# Altium project PCB_Project1.PrjPCB
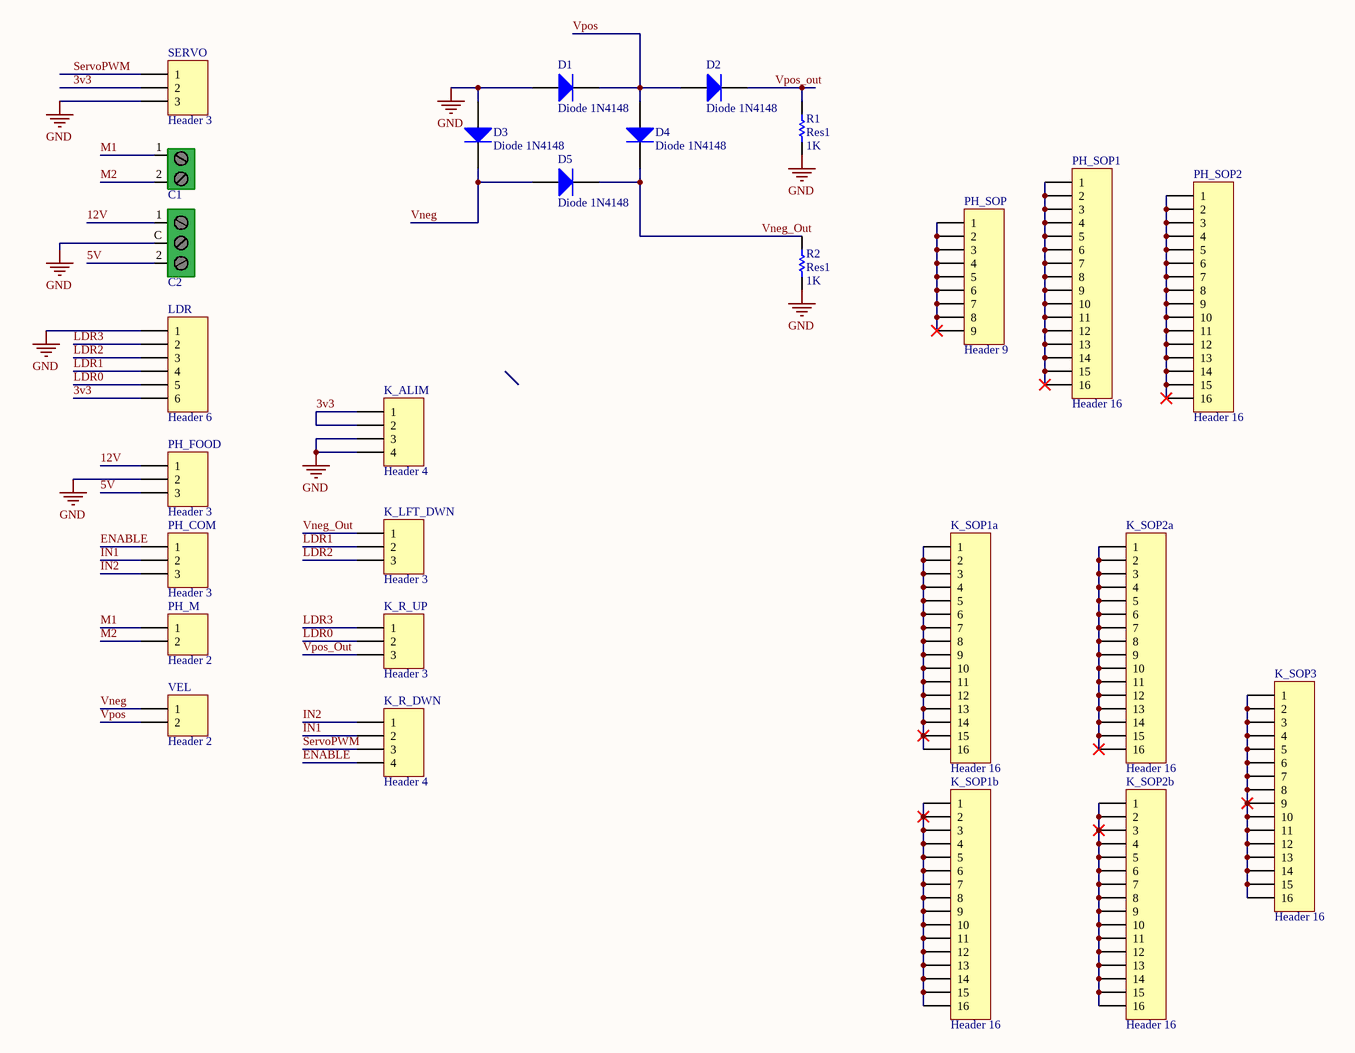
[diagram p0: Sheet1.SchDoc]
1 sheet, 27 parts. Net scope: global (net labels, ports and power ports of the same name join across sheets).
Board file: PCB1.PcbDoc

## Sheet Sheet1.SchDoc
size D

### Parts
C1  Conector_2x  [Conector_2x]  (value not drawn)
C2  Conector_3x  [Conector_3x]  (value not drawn)
D1  Diode 1N4148  [DO-35]
D2  Diode 1N4148  [DO-35]
D3  Diode 1N4148  [DO-35]
D4  Diode 1N4148  [DO-35]
D5  Diode 1N4148  [DO-35]
K_ALIM  Header 4  [HDR1X4]
K_LFT_DWN  Header 3  [HDR1X3]
K_R_DWN  Header 4  [HDR1X4]
K_R_UP  Header 3  [HDR1X3]
K_SOP1a  Header 16  [HDR1X16]
K_SOP1b  Header 16  [HDR1X16]
K_SOP2a  Header 16  [HDR1X16]
K_SOP2b  Header 16  [HDR1X16]
K_SOP3  Header 16  [HDR1X16]
LDR  Header 6  [HDR1X6]
PH_COM  Header 3  [HDR1X3]
PH_FOOD  Header 3  [HDR1X3]
PH_M  Header 2  [HDR1X2]
PH_SOP  Header 9  [HDR1X9]
PH_SOP1  Header 16  [HDR1X16]
PH_SOP2  Header 16  [HDR1X16]
R1  Res1  value 1K  [AXIAL-0.3]
R2  Res1  value 1K  [AXIAL-0.3]
SERVO  Header 3  [HDR1X3]
VEL  Header 2  [HDR1X2]

### Nets
GND: C2.C D1.1(A) D3.1(A) K_ALIM.3 K_ALIM.4 LDR.1 PH_FOOD.2 R1.1 R2.1 SERVO.3
3v3: K_ALIM.1 K_ALIM.2 LDR.6 SERVO.2
5V: C2.2 PH_FOOD.3
12V: C2.1 PH_FOOD.1
ENABLE: K_R_DWN.4 PH_COM.1
IN1: K_R_DWN.2 PH_COM.2
IN2: K_R_DWN.1 PH_COM.3
LDR0: K_R_UP.2 LDR.5
LDR1: K_LFT_DWN.2 LDR.4
LDR2: K_LFT_DWN.3 LDR.3
LDR3: K_R_UP.1 LDR.2
M1: C1.1 PH_M.1
M2: C1.2 PH_M.2
ServoPWM: K_R_DWN.3 SERVO.1
Vneg: D3.2(K) D5.1(A) VEL.1
Vneg_Out: D4.2(K) D5.2(K) K_LFT_DWN.1 R2.2
Vpos: D1.2(K) D2.1(A) D4.1(A) VEL.2
Vpos_out: D2.2(K) K_R_UP.3 R1.2
NetK_SOP1a_1: K_SOP1a.1 K_SOP1a.2 K_SOP1a.3 K_SOP1a.4 K_SOP1a.5 K_SOP1a.6 K_SOP1a.7 K_SOP1a.8 K_SOP1a.9 K_SOP1a.10 K_SOP1a.11 K_SOP1a.12 K_SOP1a.13 K_SOP1a.14 K_SOP1a.15 K_SOP1a.16
NetK_SOP1b_1: K_SOP1b.1 K_SOP1b.2 K_SOP1b.3 K_SOP1b.4 K_SOP1b.5 K_SOP1b.6 K_SOP1b.7 K_SOP1b.8 K_SOP1b.9 K_SOP1b.10 K_SOP1b.11 K_SOP1b.12 K_SOP1b.13 K_SOP1b.14 K_SOP1b.15 K_SOP1b.16
NetK_SOP2a_1: K_SOP2a.1 K_SOP2a.2 K_SOP2a.3 K_SOP2a.4 K_SOP2a.5 K_SOP2a.6 K_SOP2a.7 K_SOP2a.8 K_SOP2a.9 K_SOP2a.10 K_SOP2a.11 K_SOP2a.12 K_SOP2a.13 K_SOP2a.14 K_SOP2a.15 K_SOP2a.16
NetK_SOP2b_1: K_SOP2b.1 K_SOP2b.2 K_SOP2b.3 K_SOP2b.4 K_SOP2b.5 K_SOP2b.6 K_SOP2b.7 K_SOP2b.8 K_SOP2b.9 K_SOP2b.10 K_SOP2b.11 K_SOP2b.12 K_SOP2b.13 K_SOP2b.14 K_SOP2b.15 K_SOP2b.16
NetK_SOP3_1: K_SOP3.1 K_SOP3.2 K_SOP3.3 K_SOP3.4 K_SOP3.5 K_SOP3.6 K_SOP3.7 K_SOP3.8 K_SOP3.9 K_SOP3.10 K_SOP3.11 K_SOP3.12 K_SOP3.13 K_SOP3.14 K_SOP3.15 K_SOP3.16
NetPH_SOP1_1: PH_SOP1.1 PH_SOP1.2 PH_SOP1.3 PH_SOP1.4 PH_SOP1.5 PH_SOP1.6 PH_SOP1.7 PH_SOP1.8 PH_SOP1.9 PH_SOP1.10 PH_SOP1.11 PH_SOP1.12 PH_SOP1.13 PH_SOP1.14 PH_SOP1.15 PH_SOP1.16
NetPH_SOP2_1: PH_SOP2.1 PH_SOP2.2 PH_SOP2.3 PH_SOP2.4 PH_SOP2.5 PH_SOP2.6 PH_SOP2.7 PH_SOP2.8 PH_SOP2.9 PH_SOP2.10 PH_SOP2.11 PH_SOP2.12 PH_SOP2.13 PH_SOP2.14 PH_SOP2.15 PH_SOP2.16
NetPH_SOP_1: PH_SOP.1 PH_SOP.2 PH_SOP.3 PH_SOP.4 PH_SOP.5 PH_SOP.6 PH_SOP.7 PH_SOP.8 PH_SOP.9

### Library data of the parts
D1-D5 = Diode 1N4148: High Conductance Fast Diode; Published: 8-Jun-2000; LatestRevisionDate: 17-Jul-2002; LatestRevisionNote: Re-released for DXP Platform.; DatasheetVersion: 1997; PackageReference: DO-35; Publisher: Altium Limited; PackageDescription: Diode, Axial; Body 3.8 x 1.9 mm (LxDia. max), Lead Dia. 0.53 mm (max); Code_JEDEC: DO-204-AH; ComponentLink1Description: Manufacturer Link; ComponentLink1URL: http://www.fairchildsemi.com/; ComponentLink2Description: Datasheet; ComponentLink2URL: http://www.fairchildsemi.com/ds/1N%2F1N4148.pdf
K_ALIM K_R_DWN = Header 4: Header, 4-Pin; LatestRevisionDate: 17-Jul-2002; LatestRevisionNote: Re-released for DXP Platform.; Publisher: Altium Limited
K_LFT_DWN K_R_UP PH_COM PH_FOOD SERVO = Header 3: Header, 3-Pin; LatestRevisionDate: 17-Jul-2002; LatestRevisionNote: Re-released for DXP Platform.; Publisher: Altium Limited
K_SOP1a K_SOP1b K_SOP2a K_SOP2b K_SOP3 PH_SOP1 PH_SOP2 = Header 16: Header, 16-Pin; LatestRevisionDate: 17-Jul-2002; LatestRevisionNote: Re-released for DXP Platform.; Publisher: Altium Limited
LDR = Header 6: Header, 6-Pin; LatestRevisionDate: 17-Jul-2002; LatestRevisionNote: Re-released for DXP Platform.; Publisher: Altium Limited
PH_M VEL = Header 2: Header, 2-Pin; LatestRevisionDate: 17-Jul-2002; LatestRevisionNote: Re-released for DXP Platform.; Publisher: Altium Limited
PH_SOP = Header 9: Header, 9-Pin; LatestRevisionDate: 17-Jul-2002; LatestRevisionNote: Re-released for DXP Platform.; Publisher: Altium Limited
R1 R2 = Res1: Resistor; Published: 8-Jun-2000; LatestRevisionDate: 17-Jul-2002; LatestRevisionNote: Re-released for DXP Platform.; PackageReference: AXIAL-0.3; Publisher: Altium Limited; PackageDescription: Axial Device, Thru-Hole; 2 Leads; 0.3 in Pin Spacing